# Altium schematic sheet CAN2.SchDoc
size A4
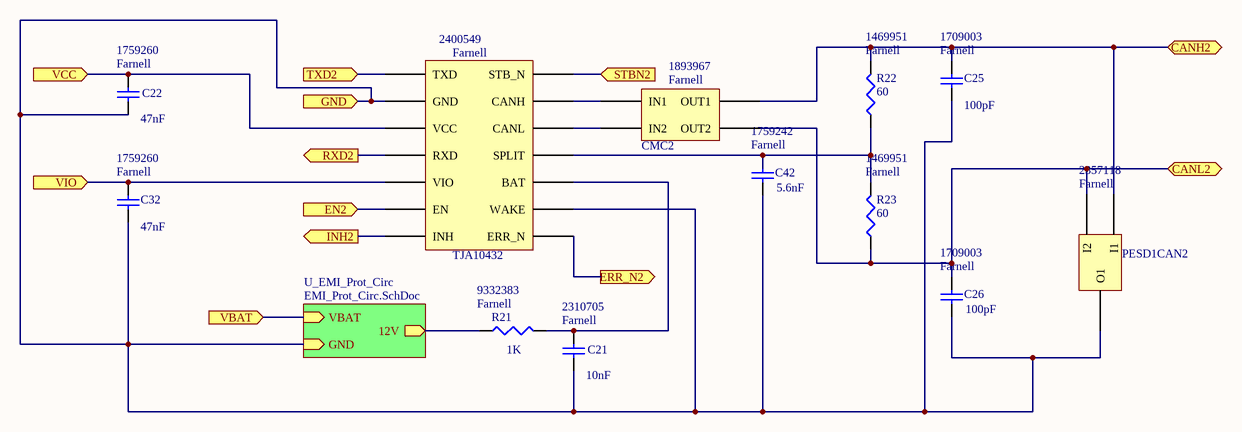
[diagram p0: CAN2.SchDoc]

## Parts
C21  value 10nF  Supplier 1: Farnell  Supplier Part Number 1: 2310705  [CAP_0805]  (hidden comment: 10n)
C22  value 47nF  Supplier 1: Farnell  Supplier Part Number 1: 1759260  [CAP_0805]  (hidden comment: 47n)
C25  value 100pF  Supplier 1: Farnell  Supplier Part Number 1: 1709003  [CAP_0805]  (hidden comment: 100p)
C26  value 100pF  Supplier 1: Farnell  Supplier Part Number 1: 1709003  [CAP_0805]  (hidden comment: 100p)
C32  value 47nF  Supplier 1: Farnell  Supplier Part Number 1: 1759260  [CAP_0805]  (hidden comment: 47n)
C42  value 5.6nF  Supplier 1: Farnell  Supplier Part Number 1: 1759242  [CAP_0805]  (hidden comment: 5.6n)
CMC2  Supplier 1: Farnell  Supplier Part Number 1: 1893967  [CMC]
PESD1CAN2  Supplier 1: Farnell  Supplier Part Number 1: 2357118  [SOT32-PESD1CAN]
R21  Supplier 1: Farnell  Supplier Part Number 1: 9332383  [RES_0805]  (hidden comment: 1k)
R22  Supplier 1: Farnell  Supplier Part Number 1: 1469951  [RES_0805]  (hidden comment: 60)
R23  Supplier 1: Farnell  Supplier Part Number 1: 1469951  [RES_0805]  (hidden comment: 60)
TJA10432  Supplier 1: Farnell  Supplier Part Number 1: 2400549  [SOIC14-TJA1043]

## Sub-sheets
U_EMI_Prot_Circ = EMI_Prot_Circ.SchDoc: VBAT (in), GND (in), 12V (out)

## Ports
CANH2 (bidir), CANL2 (bidir), EN2 (in), ERR_N2 (out), GND (in), INH2 (out), RXD2 (out), STBN2 (in), TXD2 (in), VBAT (in), VCC (in), VIO (in)

## Nets
CANH2: C25.2 CMC2.OUT1 PESD1CAN2.I1 R22.2 ; port CANH2
CANL2: C26.2 CMC2.OUT2 PESD1CAN2.I2 R23.1 ; port CANL2
EN2: TJA10432.EN ; port EN2
ERR_N2: TJA10432.ERR_N ; port ERR_N2
GND: C21.1 C22.1 C25.1 C26.1 C32.1 C42.1 PESD1CAN2.O1 TJA10432.GND TJA10432.WAKE ; port GND, sheet U_EMI_Prot_Circ/GND
INH2: TJA10432.INH ; port INH2
RXD2: TJA10432.RXD ; port RXD2
STBN2: TJA10432.STB_N ; port STBN2
TXD2: TJA10432.TXD ; port TXD2
VBAT: port VBAT, sheet U_EMI_Prot_Circ/VBAT
VCC: C22.2 TJA10432.VCC ; port VCC
VIO: C32.2 TJA10432.VIO ; port VIO
NetC21_2: C21.2 R21.2 TJA10432.BAT
NetC42_2: C42.2 R22.1 R23.2 TJA10432.SPLIT
NetCMC2_IN1: CMC2.IN1 TJA10432.CANH
NetCMC2_IN2: CMC2.IN2 TJA10432.CANL
NetR21_1: R21.1 ; sheet U_EMI_Prot_Circ/12V

## Library data of the parts
C21 C22 C25 C26 C32 C42 = Cap Semi: Capacitor; Published: 8-Jun-2000; LatestRevisionDate: 29-May-2009; LatestRevisionNote: IPC-7351 Footprint Added.; PackageReference: C1206; Publisher: Altium Limited; PackageDescription: Chip Capacitor
CMC2 = Common_Mode_Choke: Common mode choke: DR331-475BE; HelpURL: http://www.mouser.com/ds/2/54/R331-777616.pdf
PESD1CAN2 = PESD1CAN: CAN bus ESD protection diode
R21-R23 = Res3: Resistor; Published: 8-Jun-2000; LatestRevisionDate: 29-May-2009; LatestRevisionNote: IPC-7351 Footprint Added.; PackageReference: J1-0603; Publisher: Altium Limited; PackageDescription: Chip Resistor
  R21: Value: 1K
  R22 R23: Value: 60
TJA10432 = TJA1043: CAN transceiver; Models: TJA10432; HelpURL: http://www.nxp.com/documents/data_sheet/TJA1043.pdf